# EAGLE design Active_Volume_Preamp (EAGLE 7.6.0)

## Sheet 1 of 2
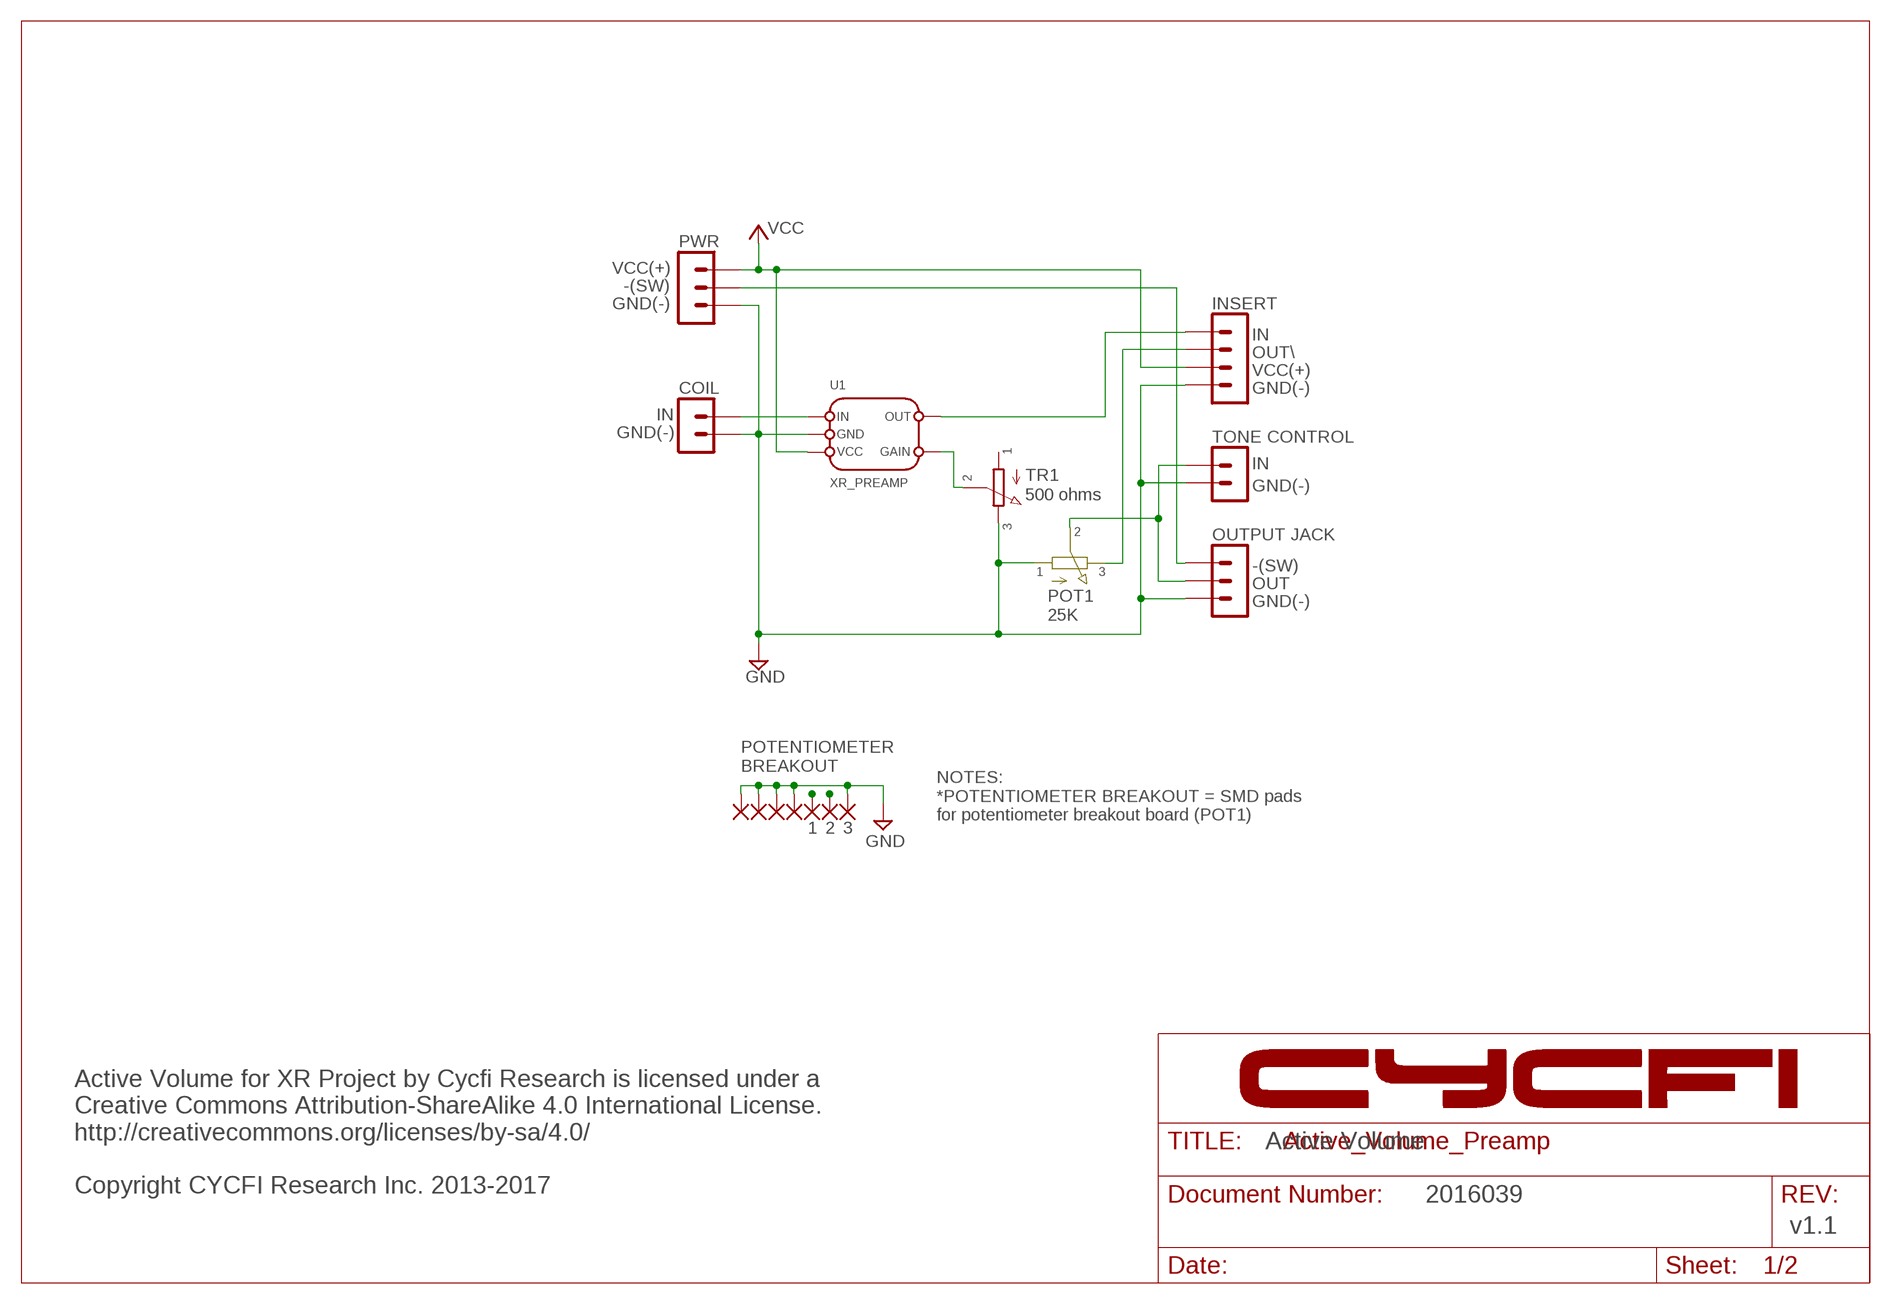
[diagram p0: schematic, sheet 1]

### Parts
PAD1  SMD2  [SMD1,27-2,54]
PAD2  SMD2  [SMD1,27-2,54]
PAD3  SMD2  [SMD1,27-2,54]
PAD4  SMD2  [SMD1,27-2,54]
PAD5  SMD2  [SMD1,27-2,54]
PAD6  SMD2  [SMD1,27-2,54]
PAD7  SMD2  [SMD1,27-2,54]
TR1  TC33X-2-201E  [TC33X-2-201E]
U1  XR_PREAMP  [XR_PREAMP_V1.5]

### Nets
GND: PAD1.1(P) PAD4.1(P) PAD5.1(P) PAD6.1(P) PAD7.1(P) TR1.P$3 U1.GND ; also sheet 2
INPUT: U1.IN ; also sheet 2
N$1: TR1.P$2 U1.GAIN
OUT(PREAMP): U1.OUT ; also sheet 2
OUT(SEL): PAD2.1(P) ; also sheet 2
OUT(VOL): PAD3.1(P) ; also sheet 2
VCC: U1.VCC ; also sheet 2
Unconnected: TR1.P$1

### Notes on the sheet
- PWR
- VCC(+)
- -(SW)
- GND(-) | INSERT
- IN
- OUT\
- VCC(+)
- COIL | GND(-)
- IN
- GND(-) | TONE CONTROL
- IN
- GND(-)
- 500 ohms
- 2
- OUTPUT JACK
- -(SW)
- 1 | 3
- OUT
- GND(-)
- POT1
  25K
- POTENTIOMETER
  BREAKOUT
- NOTES:
  *POTENTIOMETER BREAKOUT = SMD pads
  for potentiometer breakout board (POT1)
- 1 | 2 | 3
- Active Volume
- Active Volume for XR Project by Cycfi Research is licensed under a
  Creative Commons Attribution-ShareAlike 4.0 International License. 
  http://creativecommons.org/licenses/by-sa/4.0/ 
  
  Copyright CYCFI Research Inc. 2013-2017
- 2016039
- v1.1

## Sheet 2 of 2
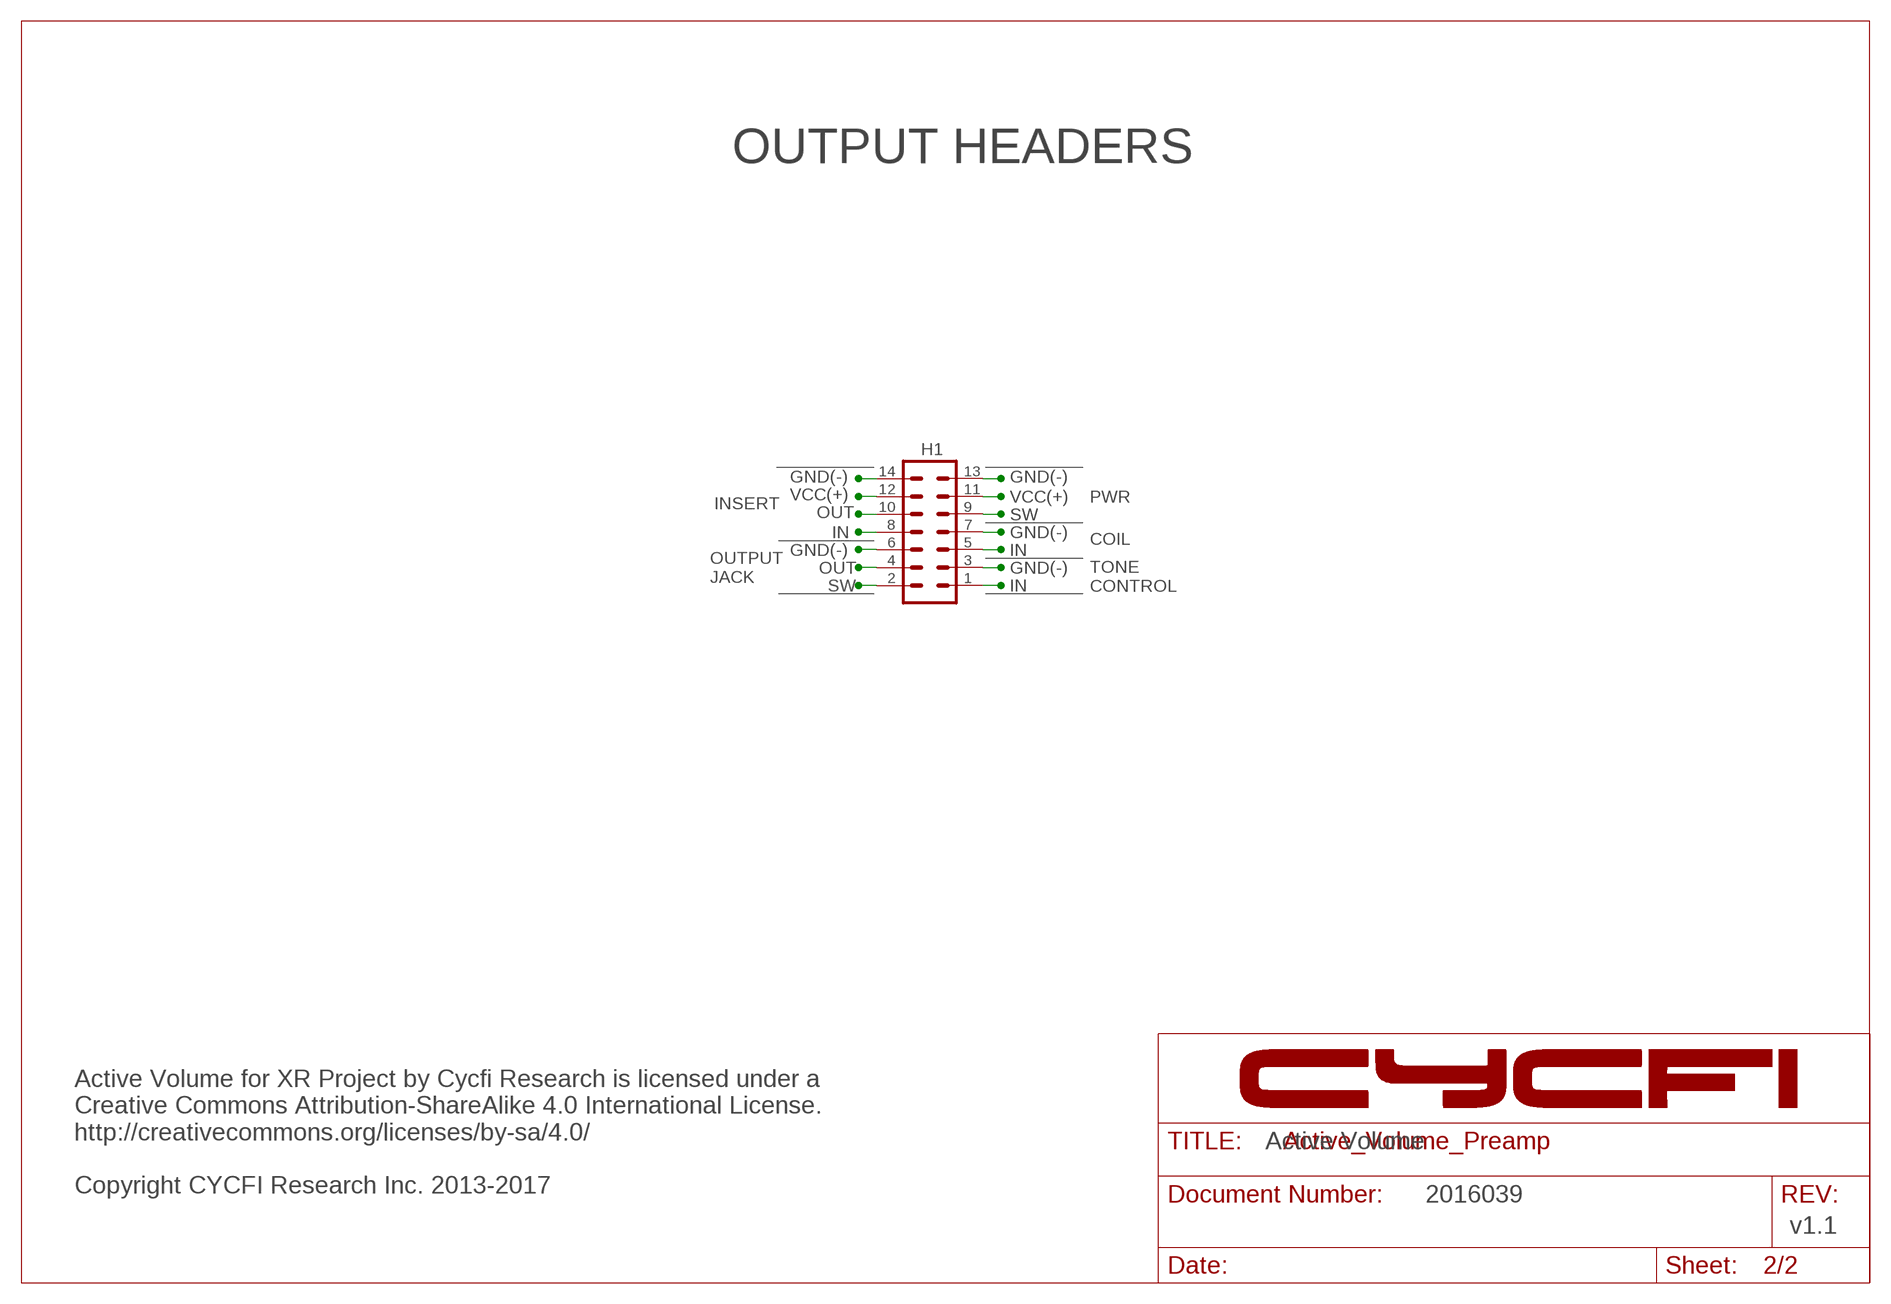
[diagram p1: schematic, sheet 2]

### Parts
H1  MA07-2  [MA07-2]

### Nets
GND: H1.3 H1.6 H1.7 H1.13 H1.14 ; also sheet 1
INPUT: H1.5 ; also sheet 1
OUT(PREAMP): H1.8 ; also sheet 1
OUT(SEL): H1.10 ; also sheet 1
OUT(VOL): H1.1 H1.4 ; also sheet 1
SW: H1.2 H1.9 ; also sheet 1
VCC: H1.11 H1.12 ; also sheet 1

### Notes on the sheet
- OUTPUT HEADERS
- GND(-) | GND(-)
- VCC(+) | VCC(+) | PWR
- INSERT
- OUT | SW
- IN | GND(-)
- COIL
- GND(-) | IN
- OUT | GND(-)
- OUTPUT
  JACK
- SW | IN
- TONE
  CONTROL
- Active Volume
- Active Volume for XR Project by Cycfi Research is licensed under a
  Creative Commons Attribution-ShareAlike 4.0 International License. 
  http://creativecommons.org/licenses/by-sa/4.0/ 
  
  Copyright CYCFI Research Inc. 2013-2017
- 2016039
- v1.1

## Library data of the parts
H1 = con-lstb:MA07-2: PIN HEADER; OC_FARNELL: unknown; OC_NEWARK: unknown
PAD1-PAD7 = wirepad:SMD2: SMD PAD
TR1 = CYCFI_Passive:TC33X-2-201E
U1 = CYCFI_Module_castellated:XR_PREAMP

## Board
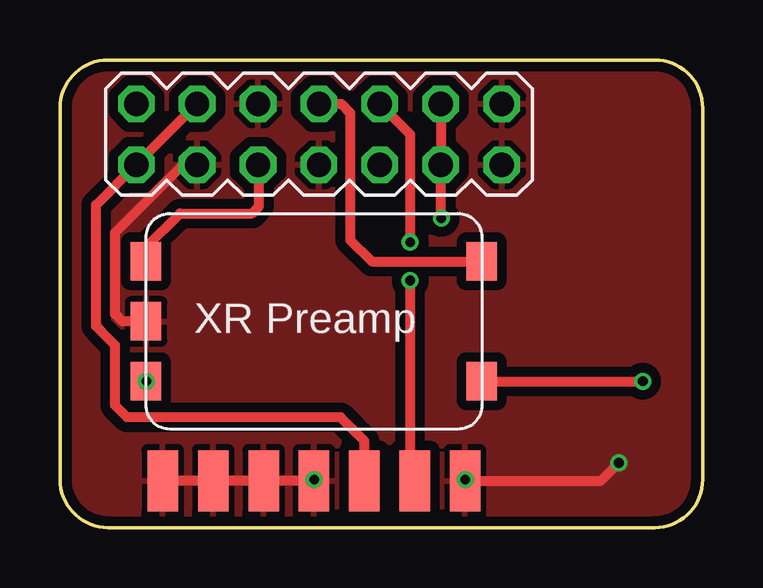
[diagram p2: board, top side]
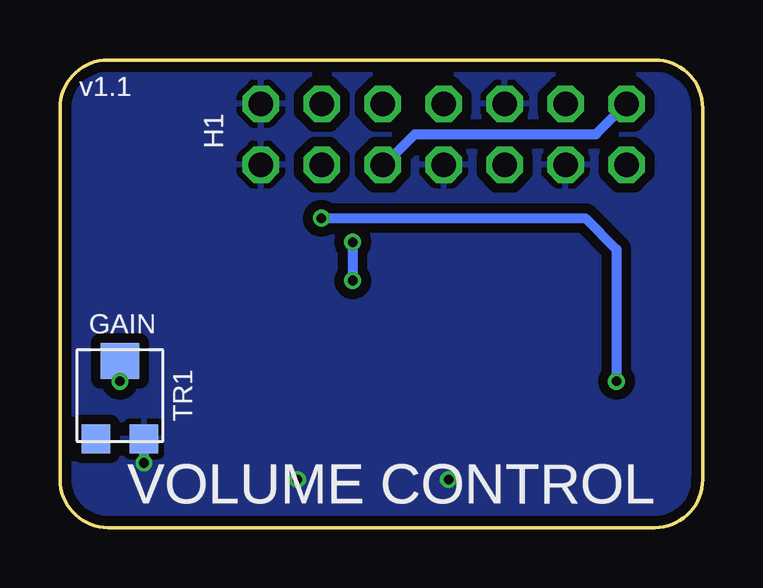
[diagram p3: board, bottom side, seen from below]

Size 26.8 x 19.5 mm. Coordinates in mm from the lower left corner, seen from the top.
Outline: 0,17.5 0,2 arc90 2,0 24.8,0 arc90 26.8,2 26.8,17.5 arc90 24.8,19.5 2,19.5 arc90 0,17.5
Copper layers (1*16): Top 0.035mm / dielectric 1.5mm / Bottom 0.035mm
Design rules "Fusion_eagle_rule_v1.1": minimum track width 6mil, minimum drill 12mil, track to track 6mil, track to pad 6mil, pad to pad 6mil, via to via 6mil, smd to smd 0mil, copper to edge 10mil, drill to drill 10mil, minimum pad ring 10mil, minimum via ring 6mil, stop-mask expansion 2mil, vias tented up to drill 100mil, thermal gap 10mil

### Footprints (pad centres in the part's own frame; a part is rotated, then mirrored left to right if it is on the bottom)
MA07-2 = drill 1.016 octagon: 1 -7.62,-1.27; 2 -7.62,1.27; 3 -5.08,-1.27; 4 -5.08,1.27; 5 -2.54,-1.27; 6 -2.54,1.27; 7 0,-1.27; 8 0,1.27; 9 2.54,-1.27; 10 2.54,1.27; 11 5.08,-1.27; 12 5.08,1.27; 13 7.62,-1.27; 14 7.62,1.27
SMD1,27-2,54 = smd 1.27 x 2.54: 1 0,0
TC33X-2-201E = smd 1.2 x 1.2: P$1 -1,-1.8; P$3 1,-1.8 | smd 1.6 x 1.5: P$2 0,1.45
XR_PREAMP_V1.5 = smd 1.27 x 1.6: GAIN 7,-2.5; GND -7,0; IN -7,2.5; OUT 7,2.5; VCC -7,-2.5

### Placement (x,y rotation side)
H1  10.8,16.4 0 top
PAD1  16.89,1.95 0 top
PAD2  14.79,1.95 0 top
PAD3  12.69,1.95 0 top
PAD4  10.59,1.95 0 top
PAD5  8.49,1.95 0 top
PAD6  6.39,1.95 0 top
PAD7  4.29,1.95 0 top
TR1  24.3,5.5 0 bottom
U1  10.59,8.6 0 top

### Tracks (layer width: path | path; a pad name or v marks a point on that pad's centre or on a via)
GND  (via drill 0.4)
  Top 0.406: U1.GND 2.6,8.6 2.3,8.9 2.3,12.3 4.4,14.4 4.9,14.9 5,15 5.1,15.1 5.69,15.1 | PAD4.1 PAD5.1 PAD6.1 PAD7.1 | v23.3,2.7 22.55,1.95 PAD1.1 v16.89,1.99 v16.9,2
  Bottom 0.406: v23.3,2.7 TR1.P$3
  other vias: 10.6,2
  pour Top (isolate 0.406): 26.8,17.5 26.8,2 arc-90 24.8,0 2,0 arc-90 0,2 0,17.5 arc-90 2,19.5 24.8,19.5 arc-90
  pour Bottom (isolate 0.406): 26.8,17.5 26.8,2 arc-90 24.8,0 2,0 arc-90 0,2 0,17.5 arc-90 2,19.5 24.8,19.5 arc-90
INPUT
  Top 0.406: U1.IN 3.59,11.69 5,13.1 8,13.1 8.3,13.4 8.3,15.09 H1.5
N$1  (via drill 0.4)
  Top 0.406: U1.GAIN v24.3,6.1
  Bottom 0.406: v24.3,6.1 TR1.P$2
OUT(PREAMP)
  Top 0.406: H1.8 11.73,17.67 12.1,17.3 12.1,12 13,11.1 U1.OUT
OUT(SEL)  (via drill 0.4)
  Top 0.406: H1.10 14.6,16.4 v14.6,11.9 | v14.6,10.3 14.6,2.14 PAD2.1
  Bottom 0.406: v14.6,11.9 v14.6,10.3
OUT(VOL)
  Top 0.406: PAD3.1 12.69,3.61 12.2,4.1 11.7,4.6 2.8,4.6 2.3,5.1 2.3,7.6 1.7,8.2 1.5,8.4 1.5,13.45 H1.1 H1.4
SW
  Bottom 0.406: H1.2 4.45,16.4 7.3,16.4 12,16.4 13.27,15.13 H1.9
VCC  (via drill 0.4)
  Top 0.406: v15.9,12.9 15.88,12.92 H1.11 H1.12 | v3.6,6.1 v3.6,6.09 U1.VCC
  Bottom 0.406: v15.9,12.9 4.9,12.9 3.6,11.6 v3.6,6.1

### Text on the board
bNames: v1.1 | GAIN | VOLUME CONTROL
_bNames: v1.1 | H1 | GAIN | TR1 | VOLUME CONTROL